# Altium project NavIC_F9P_RTK.PrjPcb
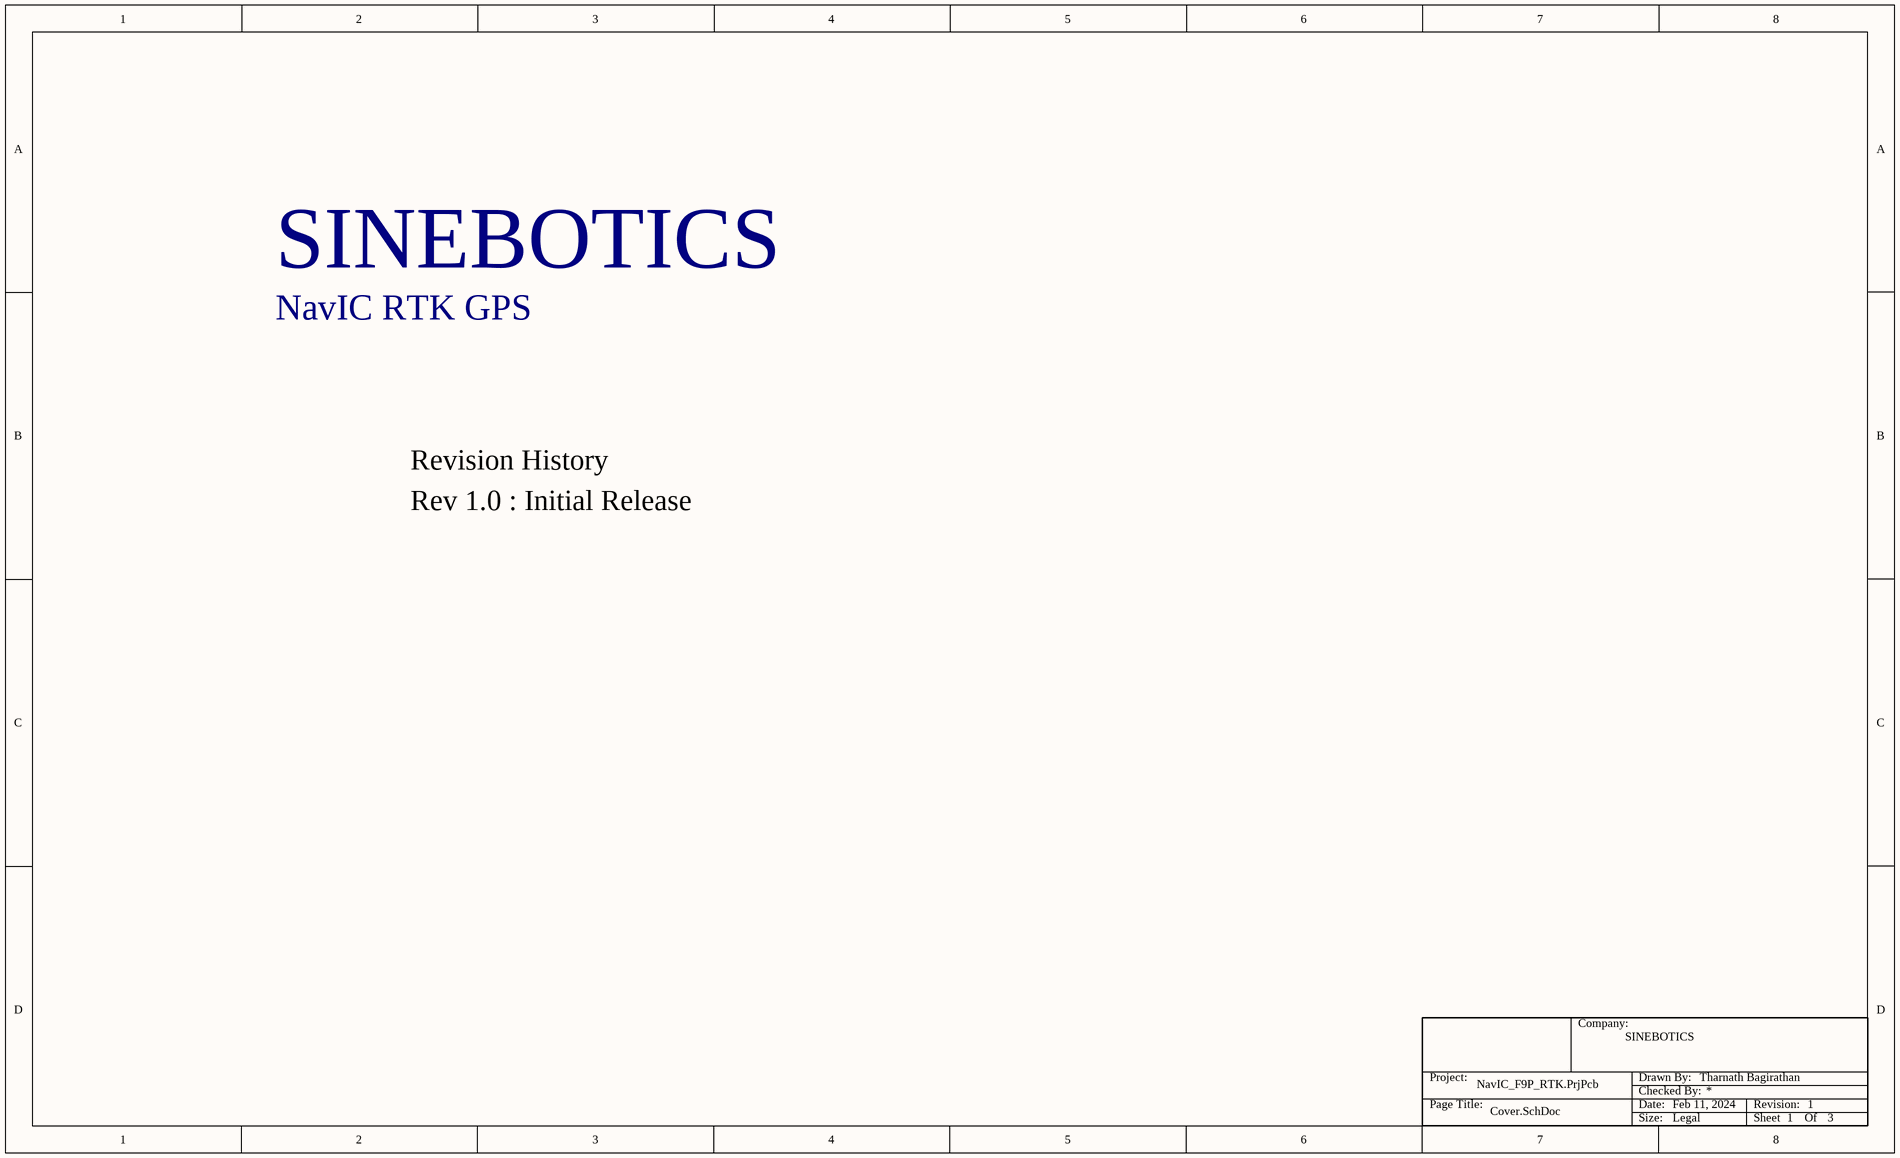
[diagram p0: Cover.SchDoc]
Date: Feb 11, 2024; Revision: 1; Size: Legal
3 sheets, 128 parts. Net scope: flat (ports and power ports of the same name join across sheets).
Board file: NavIC_PCB.PcbDoc
Sheets:
  Cover.SchDoc
  Power.SchDoc
  Sensors.SchDoc

## Sheet Cover.SchDoc
size Legal; CompanyName: SINEBOTICS; DrawnBy: Tharnath Bagirathan; SheetNumber: 1; SheetTotal: 3

### Parts
(Parts that share a designator on the sheet are numbered #1, #2 ... from top to bottom, then left to right.)
TitleBlock#1  TitleBlock  (value not drawn)  (graphical)

### Notes on the sheet
- SINEBOTICS
- NavIC RTK GPS
- Revision History
- Rev 1.0 : Initial Release
- (in symbol TitleBlock) Company:; Project:; Drawn By:; Checked By:; Page Title:; Date:; Revision:; Size:; Sheet        Of

### Library data of the parts
TitleBlock#1 = TitleBlock: TitleBlock For Schematics

## Sheet Power.SchDoc
size Legal; CompanyName: SINEBOTICS; DrawnBy: Tharnath Bagirathan; SheetNumber: 2; SheetTotal: 3
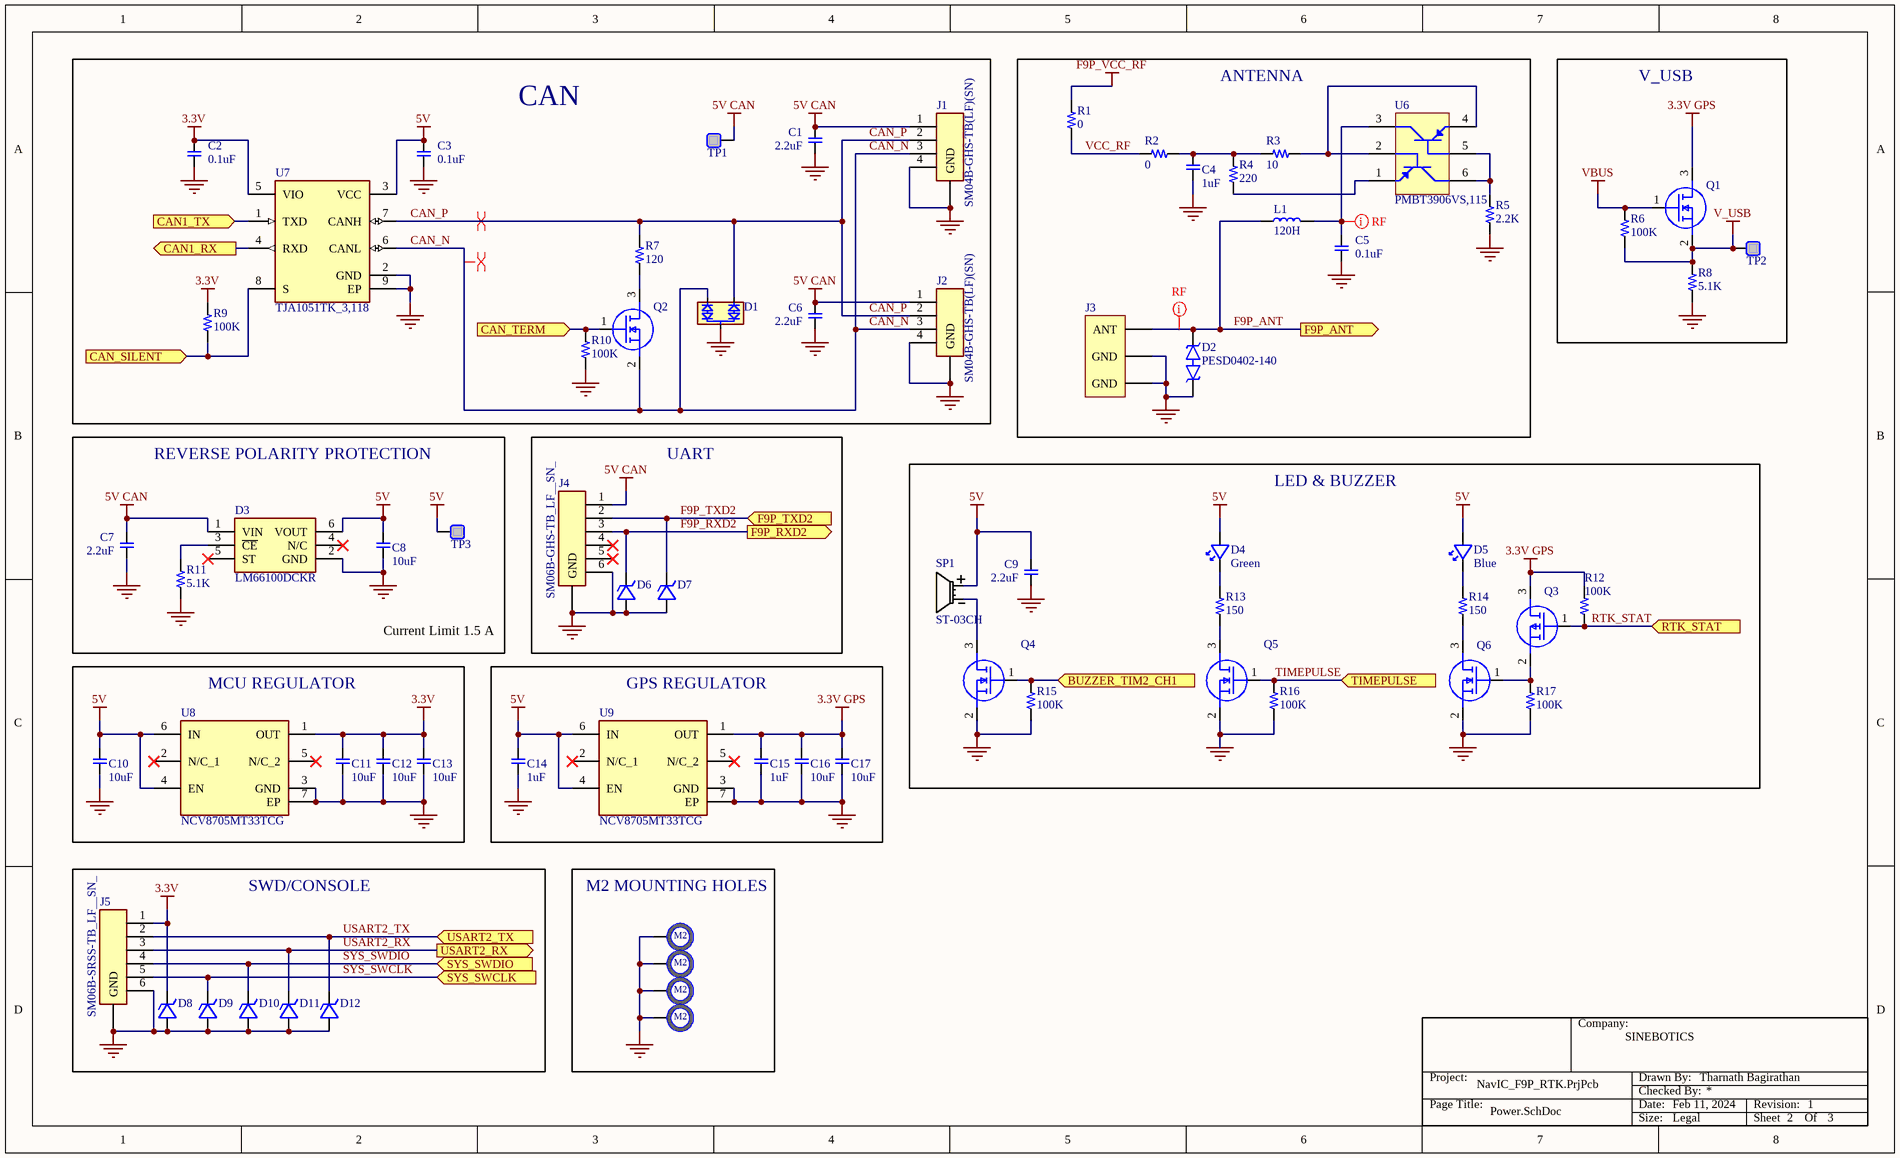
[diagram p1: Power.SchDoc]

### Parts
(Parts that share a designator on the sheet are numbered #1, #2 ... from top to bottom, then left to right.)
C1  2.2uF  [C0402]
C2  0.1uF  [C0402]
C3  0.1uF  [C0402]
C4  1uF  [C0402]
C5  0.1uF  [C0402]
C6  2.2uF  [C0402]
C7  2.2uF  [C0402]
C8  10uF  [C0402]
C9  2.2uF  [C0402]
C10  10uF  [C0402]
C11  10uF  [C0402]
C12  10uF  [C0402]
C13  10uF  [C0402]
C14  1uF  [C0402]
C15  1uF  [C0402]
C16  10uF  [C0402]
C17  10uF  [C0402]
D1  PESD1CAN-UX  [PESD1CANUX]  (value not drawn)
D2  PESD0402-140  [DIONC1005X43N]
D3  LM66100DCKR  [SOP65P210X110-6N]
D4  Green  [LTSTS110TBKT]
D5  Blue  [LTSTS110TBKT]
D6  ESD9C3.3ST5G  [SODFL1006X40N]  (value not drawn)
D7  ESD9C3.3ST5G  [SODFL1006X40N]  (value not drawn)
D8  ESD9C3.3ST5G  [SODFL1006X40N]  (value not drawn)
D9  ESD9C3.3ST5G  [SODFL1006X40N]  (value not drawn)
D10  ESD9C3.3ST5G  [SODFL1006X40N]  (value not drawn)
D11  ESD9C3.3ST5G  [SODFL1006X40N]  (value not drawn)
D12  ESD9C3.3ST5G  [SODFL1006X40N]  (value not drawn)
H1  M2  [Hole_M2]  (value not drawn)  (no BOM)
H2  M2  [Hole_M2]  (value not drawn)  (no BOM)
H3  M2  [Hole_M2]  (value not drawn)  (no BOM)
H4  M2  [Hole_M2]  (value not drawn)  (no BOM)
J1  SM04B-GHS-TB(LF)(SN)  [SM04B-GHS-TB]
J2  SM04B-GHS-TB(LF)(SN)  [SM04B-GHS-TB]
J3  0734150963  [MOLEX_0734150963]  (value not drawn)
J4  SM06B-GHS-TB_LF__SN_  [SM06B-GHS-TB]
J5  SM06B-SRSS-TB_LF__SN_  [SM06BSRSSTBLFSN]
L1  120H  [LQW15CNR20J00B]
Q1  DMN53D0L-7  [SOT96P240X110-3N]  (value not drawn)
Q2  DMN53D0L-7  [SOT96P240X110-3N]  (value not drawn)
Q3  BSS223PWH6327XTSA1  [SOT65P210X100-3N]  (value not drawn)
Q4  DMN53D0L-7  [SOT96P240X110-3N]  (value not drawn)
Q5  DMN53D0L-7  [SOT96P240X110-3N]  (value not drawn)
Q6  DMN53D0L-7  [SOT96P240X110-3N]  (value not drawn)
R1  0  [R0402]
R2  0  [R0402]
R3  10  [RESC3225X70N]
R4  220  [R0402]
R5  2.2K  [R0402]
R6  100K  [R0402]
R7  120  [RESC1608X55N]
R8  5.1K  [R0402]
R9  100K  [R0402]
R10  100K  [R0402]
R11  5.1K  [R0402]
R12  100K  [R0402]
R13  150  [R0402]
R14  150  [R0402]
R15  100K  [R0402]
R16  100K  [R0402]
R17  100K  [R0402]
SP1  ST-03CH  [ST03CH]
TitleBlock#2  TitleBlock  (value not drawn)  (graphical)
TP1  TestPad  [TestPad]  (value not drawn)  (no BOM)
TP2  TestPad  [TestPad]  (value not drawn)  (no BOM)
TP3  TestPad  [TestPad]  (value not drawn)  (no BOM)
U6  PMBT3906VS,115  [PMBT3906VS115]
U7  TJA1051TK_3,118  [SON65P300X300X100-9N-D]
U8  NCV8705MT33TCG  [SON65P200X200X80-7N]
U9  NCV8705MT33TCG  [SON65P200X200X80-7N]

### Blocks framed on the sheet
CAN: C1-C3 C6 D1 J1 J2 Q2 R7 R9 R10 TP1 U7
ANTENNA: C4 C5 D2 J3 L1 R1-R5 U6
V_USB: Q1 R6 R8 TP2
REVERSE POLARITY PROTECTION: C7 C8 D3 R11 TP3
UART: D6 D7 J4
LED & BUZZER: C9 D4 D5 Q3-Q6 R12-R17 SP1
MCU REGULATOR: C10-C13 U8
GPS REGULATOR: C14-C17 U9
SWD/CONSOLE: D8-D12 J5
M2 MOUNTING HOLES: H1-H4

### Ports
BUZZER_TIM2_CH1 (in, see Sensors[1A]), CAN1_RX (out, see Sensors[1A]), CAN1_TX (in, see Sensors[1A]), CAN_SILENT (in, see Sensors[1B]), CAN_TERM (in, see Sensors[1B]), F9P_ANT (out, see Sensors[3A]), F9P_RXD2 (out, see Sensors[3B]), F9P_TXD2 (in, see Sensors[3B]), RTK_STAT (in, see Sensors[4B]), SYS_SWCLK (in, see Sensors[1A]), SYS_SWDIO (in, see Sensors[1A]), TIMEPULSE (in, see Sensors[4B]), USART2_RX (out, see Sensors[1A]), USART2_TX (in, see Sensors[1A])

### Nets
3.3V: C2.2 C11.1 C12.1 C13.1 D8.1(K) J5.1 R9.2 U7.5(VIO) U8.1(OUT)
3.3V GPS: C15.2 C16.1 C17.1 Q1.3(D) Q3.3(D) R12.2 U9.1(OUT)
5V: C3.2 C8.1 C9.2 C10.2 C14.2 D3.6(VOUT) D4.2(A) D5.2(A) SP1.2(+POLARITY) TP3.1 U7.3(VCC) U8.4(EN) U8.6(IN) U9.4(EN) U9.6(IN)
5V CAN: C1.2 C6.2 C7.2 D3.1(VIN) J1.1 J2.1 J4.1 TP1.1
F9P_VCC_RF: R1.2
GND: C1.1 C2.1 C3.1 C4.1 C5.1 C6.1 C7.1 C8.2 C9.1 C10.1 C11.2 C12.2 C13.2 C14.1 C15.1 C16.2 C17.2 D1.3(_COMMON_CATHODE) D2.1 D3.2(GND) D6.2(A) D7.2(A) D8.2(A) D9.2(A) D10.2(A) D11.2(A) D12.2(A) H1.1 H2.1 H3.1 H4.1 J1.0(GND) J1.4 J2.0(GND) J2.4 J3.G1(GND) J3.G2(GND) J4.6 J4.7(GND) J5.6 J5.MP(GND) Q4.2(S) Q5.2(S) Q6.2(S) R5.1 R8.1 R10.1 R11.1 R15.1 R16.1 R17.1 U7.2(GND) U7.9(EP) U8.3(GND) U8.7(EP) U9.3(GND) U9.7(EP)
V_USB: Q1.2(S) R6.1 R8.2 TP2.1
VBUS: Q1.1(G) R6.2
BUZZER_TIM2_CH1: Q4.1(G) R15.2 ; port BUZZER_TIM2_CH1
CAN1_RX: U7.4(RXD) ; port CAN1_RX
CAN1_TX: U7.1(TXD) ; port CAN1_TX
CAN_N: D1.1(CATHODE_1) J1.3 J2.3 Q2.2(S) U7.6(CANL)
CAN_P: D1.2(CATHODE_2) J1.2 J2.2 R7.2 U7.7(CANH)
F9P_ANT: D2.2 J3.1(ANT) L1.1 ; port F9P_ANT
F9P_RXD2: D6.1(K) J4.3 ; port F9P_RXD2
F9P_TXD2: D7.1(K) J4.2 ; port F9P_TXD2
RTK_STAT: Q3.1(G) R12.1 ; port RTK_STAT
SYS_SWCLK: D9.1(K) J5.5 ; port SYS_SWCLK
SYS_SWDIO: D10.1(K) J5.4 ; port SYS_SWDIO
TIMEPULSE: Q5.1(G) R16.2 ; port TIMEPULSE
USART2_RX: D11.1(K) J5.3 ; port USART2_RX
USART2_TX: D12.1(K) J5.2 ; port USART2_TX
VCC_RF: R1.1 R2.1
NetC4_2: C4.2 R2.2 R3.1 R4.2
NetC5_2: C5.2 L1.2 U6.3(COLLECTOR_TR2)
NetD3_3: D3.3(~{CE}) R11.2
NetD4_1: D4.1(K) R13.1
NetD5_1: D5.1(K) R14.1
NetQ2_1: Q2.1(G) R10.2 ; port CAN_TERM
NetQ2_3: Q2.3(D) R7.1
NetQ3_2: Q3.2(S) Q6.1(G) R17.2
NetQ4_3: Q4.3(D) SP1.3(-POLARITY)
NetQ5_3: Q5.3(D) R13.2
NetQ6_3: Q6.3(D) R14.2
NetR3_2: R3.2 U6.2(BASE_TR1) U6.4(EMITTER_TR2)
NetR4_1: R4.1 U6.1(EMITTER_TR1)
NetR5_2: R5.2 U6.5(BASE_TR2) U6.6(COLLECTOR_TR1)
NetR9_1: R9.1 U7.8(S) ; port CAN_SILENT

Not connected (* = marked no-connect by the designer): D3 4(N/C)* 5(ST)*; J4 4* 5*; SP1 1(NC_1) 4(NC_2); U8 2(N/C_1)* 5(N/C_2)*; U9 2(N/C_1)* 5(N/C_2)*

### Layout directives
differential pair: CAN_N, CAN_P
net class RF: F9P_ANT, NetC5_2

### Notes on the sheet
- Current Limit 1.5 A
- (in symbol TitleBlock) Company:; Project:; Drawn By:; Checked By:; Page Title:; Date:; Revision:; Size:; Sheet        Of

### Library data of the parts
C1 C6 C7 C9 = CAP_0402: Capacitor 0402 Generic; Manufacturer Part Number: GRM155R61A225ME95D; Manufacturer: Murata; Manufacturer Part Description: CAP CER 2.2uF ±20% 10V X5R 0402 (1005 Metric)
C2 C3 C5 = CAP_0402: Capacitor 0402 Generic; Manufacturer Part Number: 0402X104K250CT; Manufacturer: Walsin Technology Corporation; Manufacturer Part Description: CAP CER 0.1uF ±10% 25V X5R 0402 (1005 Metric)
C4 C14 C15 = CAP_0402: Capacitor 0402 Generic; Manufacturer Part Number: CL05A105KP5NNNC; Manufacturer: Samsung Electro-Mechanics; Manufacturer Part Description: CAP CER 1uF ±10% 10V X5R 0402 (1005 Metric)
C8 C10-C13 C16 C17 = CAP_0402: Capacitor 0402 Generic; Manufacturer Part Number: CL05A106MP8NUB8; Manufacturer: Samsung Electro-Mechanics; Manufacturer Part Description: CAP CER 10uF ±20% 10V X5R 0402 (1005 Metric)
D1 = PESD1CAN-UX: Diode; Manufacturer Name: Nexperia; Datasheet Link: https://assets.nexperia.com/documents/data-sheet/PESD1CAN-U.pdf; Height: 1.1mm; Manufacturer_Part_Number: PESD1CAN-UX; Mouser Price/Stock: https://www.mouser.co.uk/ProductDetail/Nexperia/PESD1CAN-UX?qs=fi7yB2oewZmfG%252BI%252BwWS45Q%3D%3D; Arrow Part Number: PESD1CAN-UX; Arrow Price/Stock: https://www.arrow.com/en/products/pesd1can-ux/nexperia?region=nac; Manufacturer Part Number: PESD1CAN-UX
D2 = PESD0402-140: TVS Diode (Bi-directional); Manufacturer Name: LITTELFUSE; Datasheet Link: https://www.littelfuse.com/~/media/electronics/product_specifications/polymer_esd_suppressors/littelfuse_polymer_esd_suppressor_pesd0402_140_product_specification.pdf.pdf; Height: 0.43mm; Manufacturer_Part_Number: PESD0402-140; Mouser Price/Stock: https://www.mouser.co.uk/ProductDetail/Littelfuse/PESD0402-140?qs=y1EbU1W0OrtTHVfbQV6MTg%3D%3D; Arrow Part Number: PESD0402-140; Arrow Price/Stock: https://www.arrow.com/en/products/pesd0402-140/littelfuse?region=nac; Manufacturer Part Number: PESD0402-140
D3 = LM66100DCKR: Diode; Manufacturer Name: Texas Instruments; Datasheet Link: http://www.ti.com/lit/gpn/LM66100; Height: 1.1mm; Mouser Price/Stock: https://www.mouser.co.uk/ProductDetail/Texas-Instruments/LM66100DCKR?qs=vLWxofP3U2y2yPPrXoBBoA%3D%3D; Arrow Part Number: LM66100DCKR; Arrow Price/Stock: https://www.arrow.com/en/products/lm66100dckr/texas-instruments?region=europe; Manufacturer Part Number: LM66100DCKR
D4 = LTST-S110KGKT: LED; Manufacturer Name: Lite-On; Datasheet Link: https://www.mouser.com/datasheet/2/239/LTST-S110KGKT-1142085.pdf; Height: 1.5mm; Mouser Price/Stock: https://www.mouser.co.uk/ProductDetail/Lite-On/LTST-S110TBKT?qs=NfjNG%252BhMu8ZWYNEUDjruGQ%3D%3D; Arrow Part Number: LTST-S110TBKT; Arrow Price/Stock: https://www.arrow.com/en/products/ltst-s110tbkt/lite-on-technology?region=europe; Manufacturer Part Number: LTST-S110KGKT
D5 = LTST-S110TBKT: LED; Manufacturer Name: Lite-On; Datasheet Link: https://datasheet.datasheetarchive.com/originals/distributors/Datasheets-DGA13/1154201.pdf; Height: 1.5mm; Mouser Price/Stock: https://www.mouser.co.uk/ProductDetail/Lite-On/LTST-S110TBKT?qs=NfjNG%252BhMu8ZWYNEUDjruGQ%3D%3D; Arrow Part Number: LTST-S110TBKT; Arrow Price/Stock: https://www.arrow.com/en/products/ltst-s110tbkt/lite-on-technology?region=europe; Manufacturer Part Number: LTST-S110TBKT
D6-D12 = ESD9C3.3ST5G: TVS Diode (Uni-directional); Manufacturer Name: onsemi; Datasheet Link: https://componentsearchengine.com/Datasheets/1/ESD9C3.3ST5G.pdf; Height: 0.4mm; Mouser Price/Stock: https://www.mouser.co.uk/ProductDetail/onsemi/SZESD9C3.3ST5G?qs=dbuNSGnowt0DiTOhuMf8NQ%3D%3D; Arrow Part Number: SZESD9C3.3ST5G; Arrow Price/Stock: https://www.arrow.com/en/products/szesd9c3.3st5g/on-semiconductor; Manufacturer Part Number: ESD9C3.3ST5G
H1-H4 = Hole_M2
J1 J2 = SM04B-GHS-TB(LF)(SN): Connector; pin to pad: 0>5+6; Manufacturer Name: JST (JAPAN SOLDERLESS TERMINALS); Datasheet Link: http://uk.rs-online.com/web/p/products/7521797; Manufacturer_Part_Number: SM04B-GHS-TB(LF)(SN); Arrow Part Number: SM04B-GHS-TB(LF)(SN); Arrow Price/Stock: https://www.arrow.com/en/products/sm04b-ghs-tb-lf-sn-/jst-manufacturing?region=europe; Manufacturer Part Number: SM04B-GHS-TB(LF)(SN)
J3 = 0734150963: MMCX Connector Jack, Female Socket 50Ohm Board Edge, Cutout; Surface Mount Solder; MF: Molex; Price: None; Purchase-URL: https://pricing.snapeda.com/search/part/0734150963/?ref=eda; Package: None; Check_prices: https://www.snapeda.com/parts/0734150963/Molex/view-part/?ref=eda; Availability: In Stock; MP: 0734150963; Value: *; SnapEDA_Link: https://www.snapeda.com/parts/0734150963/Molex/view-part/?ref=snap
J4 = SM06B-GHS-TB_LF__SN_: Connector; pin to pad: 7>7+8; Manufacturer_Part_Number: SM06B-GHS-TB(LF)(SN); Manufacturer Name: JST (JAPAN SOLDERLESS TERMINALS); Datasheet Link: https://datasheet.datasheetarchive.com/originals/distributors/Datasheets_SAMA/e4ef010dc292ea31091454f6c0afb63a.pdf; Arrow Part Number: SM06B-GHS-TB(LF)(SN); Arrow Price/Stock: https://www.arrow.com/en/products/sm06b-ghs-tb-lf-sn/jst-manufacturing; Manufacturer Part Number: SM06B-GHS-TB(LF)(SN)
J5 = SM06B-SRSS-TB_LF__SN_: Connector; pin to pad: MP>MP1+MP2; Manufacturer Name: JST (JAPAN SOLDERLESS TERMINALS); Manufacturer Part Number: SM06B-SRSS-TB(LF)(SN); Datasheet Link: http://www.jst-mfg.com/product/pdf/eng/eSH.pdf; Height: 2.95mm; Mouser Part Number: SM06B-SRSS-TB(LF)(SN); Arrow Part Number: SM06B-SRSS-TB(LF)(SN); Arrow Price/Stock: https://www.arrow.com/en/products/sm06b-srss-tb-lf-sn/jst-manufacturing?region=europe
L1 = LQW15ANR12J00D: Inductor; Manufacturer Name: Murata Electronics; Datasheet Link: https://datasheet.datasheetarchive.com/originals/distributors/Datasheets_SAMA/97451af591734477ab6d2485aab35b5f.pdf; Height: 0.6mm; Mouser Price/Stock: https://www.mouser.co.uk/ProductDetail/Murata-Electronics/LQW15ANR12J00D/?qs=UV0HhPl4yOHsBH0%2FSRErMg%3D%3D; Arrow Part Number: LQW15ANR12J00D; Arrow Price/Stock: https://www.arrow.com/en/products/lqw15anr12j00d/murata-manufacturing?region=nac; Manufacturer Part Number: LQW15ANR12J00D
Q1 Q2 Q4-Q6 = DMN53D0L-7: MOSFET (N-Channel); Manufacturer Name: Diodes Incorporated; Datasheet Link: http://uk.rs-online.com/web/p/products/9211101P; Height: 1.1mm; Mouser Price/Stock: https://www.mouser.com/Search/Refine.aspx?Keyword=621-DMN53D0L-7; Arrow Part Number: DMN53D0L-7; Arrow Price/Stock: https://www.arrow.com/en/products/dmn53d0l-7/diodes-incorporated; Manufacturer Part Number: DMN53D0L-7
Q3 = BSS223PWH6327XTSA1: MOSFET (P-Channel); Manufacturer Name: Infineon; Datasheet Link: https://componentsearchengine.com/Datasheets/2/BSS223PWH6327XTSA1.pdf; Height: 1mm; Mouser Price/Stock: https://www.mouser.co.uk/ProductDetail/Infineon-Technologies/BSS223PWH6327XTSA1?qs=Dj8dEyEphkMhtpM4HseAjA%3D%3D; Arrow Part Number: BSS223PWH6327XTSA1; Arrow Price/Stock: https://www.arrow.com/en/products/bss223pwh6327xtsa1/infineon-technologies-ag; Manufacturer Part Number: BSS223PWH6327XTSA1
R1 R2 = RES_0402: Resistor 0402 Generic; Manufacturer: Yageo; Manufacturer Part Number: AC0402JR-070RL; Manufacturer Part Description: RES 0 Ohm Jumper 1/16W 0402 (1005 Metric)
R3 = RES_10_1/2W: Resistor; Manufacturer_Part_Number: RMCF1210JT10R0; Manufacturer Name: Stackpole Electronics; Datasheet Link: https://cs.seielect.com/catalog/SEI-RMCF_RMCP.pdf; Height: 0.7mm; Mouser Price/Stock: https://www.mouser.co.uk/ProductDetail/SEI-Stackpole/RMCF1210JT10R0?qs=FESYatJ8odJ2YkqCzkIQWw%3D%3D; Arrow Part Number: RMCF1210JT10R0; Arrow Price/Stock: https://www.arrow.com/en/products/rmcf1210jt10r0/stackpole-electronics?region=nac; Manufacturer Part Number: RMCF1210JT10R0
R4 = RES_0402: Resistor 0402 Generic; Manufacturer: Stackpole Electronics Inc; Manufacturer Part Number: RMCF0402JT220R; Manufacturer Part Description: RES 220 Ohm ±5% 1/16W 0402 (1005 Metric)
R5 = RES_0402: Resistor 0402 Generic; Manufacturer: Yageo; Manufacturer Part Number: AC0402FR-072K2L; Manufacturer Part Description: RES 2.2K Ohm ±1% 1/16W 0402 (1005 Metric)
R6 R9 R10 R12 R15-R17 = RES_0402: Resistor 0402 Generic; Manufacturer: Yageo; Manufacturer Part Number: AC0402JR-07100KL; Manufacturer Part Description: RES 100K Ohm ±5% 1/16W 0402 (1005 Metric)
R7 = RES_120: Resistor; Manufacturer_Part_Number: RMCF0603FT120R; Manufacturer Name: Stackpole Electronics; Datasheet Link: https://www.seielect.com/Catalog/SEI-RMCF_RMCP.pdf; Height: 0.55mm; Arrow Part Number: RMCF0603FT120R; Arrow Price/Stock: https://www.arrow.com/en/products/rmcf0603ft120r/stackpole-electronics; Manufacturer Part Number: RMCF0603FT120R
R8 R11 = RES_0402: Resistor 0402 Generic; Manufacturer: Yageo; Manufacturer Part Number: RC0402FR-075K1L; Manufacturer Part Description: RES 5.1K Ohm ±1% 1/16W 0402 (1005 Metric)
R13 R14 = RES_0402: Resistor 0402 Generic; Manufacturer: Stackpole Electronics Inc; Manufacturer Part Number: RC0402FR-07150RL; Manufacturer Part Description: RES 150 Ohm ±1% 1/16W 0402 (1005 Metric)
SP1 = ST-03CH: Loudspeaker or Buzzer; Manufacturer_Name: Soberton Inc.; Datasheet Link: https://www.soberton.com/wp-content/uploads/2019/02/ST-03CH-19-Feb-2019.pdf; Height: 3.5mm; Mouser Part Number: ST-03CH; Manufacturer Part Number: ST-03CH
TitleBlock#2 = TitleBlock: TitleBlock For Schematics
TP1-TP3 = TestPad: Test Pads
U6 = PMBT3906VS,115: Transistor BJT PNP; Manufacturer Name: Nexperia; Datasheet Link: https://assets.nexperia.com/documents/data-sheet/PMBT3906VS.pdf; Height: 0.6mm; Mouser Part Number: PMBT3906VS,115; Mouser Price/Stock: https://www.mouser.co.uk/ProductDetail/Nexperia/PMBT3906VS115?qs=LMSg3oBIm%2FguPDYx3FiBDA%3D%3D; Arrow Part Number: PMBT3906VS,115; Arrow Price/Stock: https://www.arrow.com/en/products/pmbt3906vs115/nexperia?region=nac; Manufacturer Part Number: PMBT3906VS,115
U7 = TJA1051TK_3,118: Integrated Circuit; Manufacturer_Name: NXP; Manufacturer_Part_Number: TJA1051TK/3,118; Datasheet Link: http://www.nxp.com/docs/en/data-sheet/TJA1051.pdf; Height: 1mm; Mouser Price/Stock: https://www.mouser.co.uk/ProductDetail/NXP-Semiconductors/TJA1051TK-3118?qs=fhAOlxDPaYVrDQ2e4g%252BBJA%3D%3D; Arrow Part Number: TJA1051TK/3,118; Arrow Price/Stock: https://www.arrow.com/en/products/tja1051tk3118/nxp-semiconductors?region=nac; Manufacturer Part Number: TJA1051TK/3,118
U8 U9 = NCV8705MT33TCG: Integrated Circuit; Manufacturer Name: onsemi; Datasheet Link: https://mouser.componentsearchengine.com/Datasheets/2/NCV8705MT33TCG.pdf; Height: 0.8mm; Mouser Part Number: NCV8705MT33TCG; Mouser Price/Stock: https://www.mouser.co.uk/ProductDetail/onsemi/NCV8705MT33TCG?qs=dbuNSGnowt08ckPc9kUZHw%3D%3D; Arrow Part Number: NCV8705MT33TCG; Arrow Price/Stock: https://www.arrow.com/en/products/ncv8705mt33tcg/on-semiconductor; Manufacturer Part Number: NCV8705MT33TCG

## Sheet Sensors.SchDoc
size Legal; Date: Feb 11, 2024; CompanyName: SINEBOTICS; DrawnBy: Tharnath Bagirathan; SheetNumber: 3; SheetTotal: 3
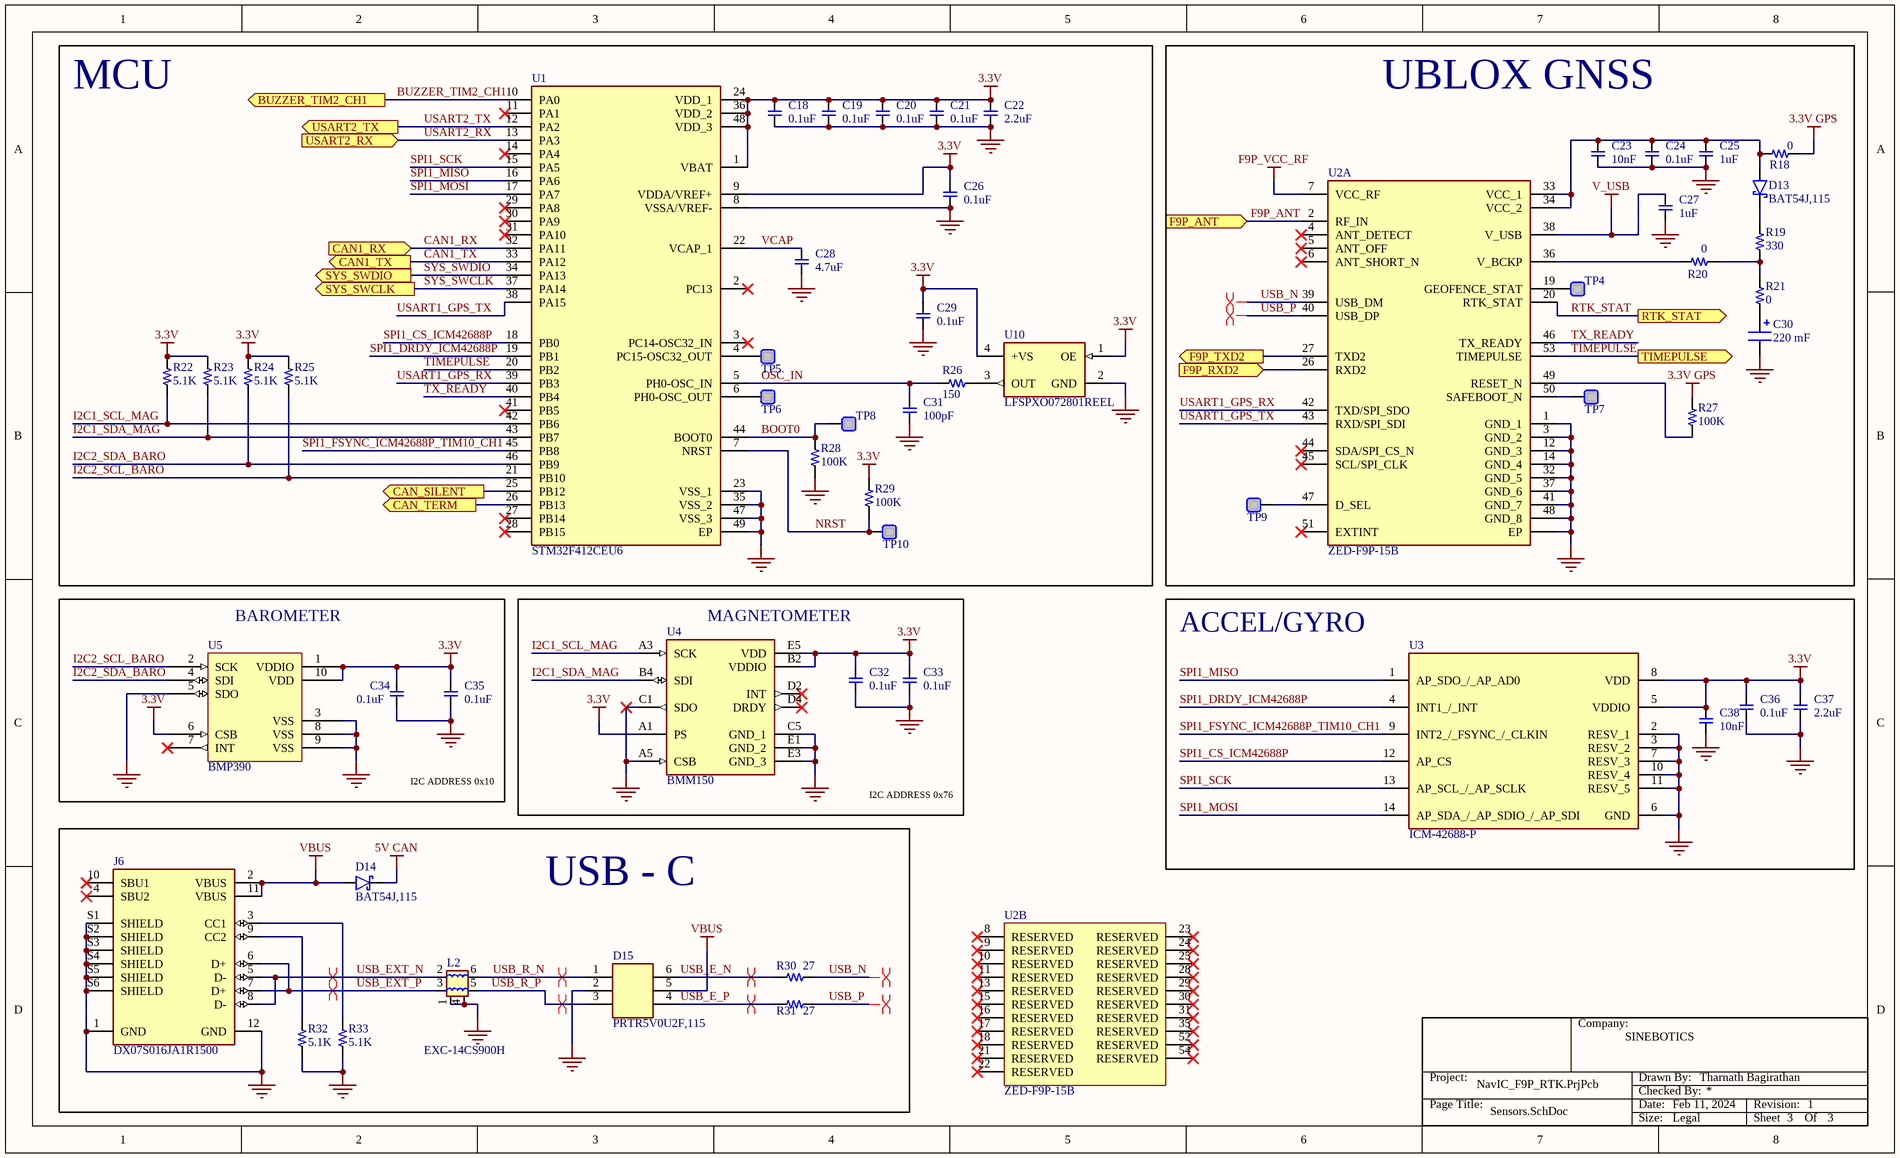
[diagram p2: Sensors.SchDoc]

### Parts
(Parts that share a designator on the sheet are numbered #1, #2 ... from top to bottom, then left to right.)
C18  0.1uF  [C0402]
C19  0.1uF  [C0402]
C20  0.1uF  [C0402]
C21  0.1uF  [C0402]
C22  2.2uF  [C0402]
C23  10nF  [C0402]
C24  0.1uF  [C0402]
C25  1uF  [C0402]
C26  0.1uF  [C0402]
C27  1uF  [C0402]
C28  4.7uF  [C0402]
C29  0.1uF  [C0402]
C30  220 mF  [DSK3R3H334THL]
C31  100pF  [C0402]
C32  0.1uF  [C0402]
C33  0.1uF  [C0402]
C34  0.1uF  [C0402]
C35  0.1uF  [C0402]
C36  0.1uF  [C0402]
C37  2.2uF  [C0402]
C38  10nF  [C0402]
D13  BAT54J,115  [SODFL2512X80N]
D14  BAT54J,115  [SODFL2512X80N]
D15  PRTR5V0U2F,115  [PESD3V3L5UF115]
J6  DX07S016JA1R1500  [JAE_DX07S016JA1R1500]
L2  EXC-14CS900H  [EXC14CS900H]
R18  0  [R0402]
R19  330  [R0402]
R20  0  [R0402]
R21  0  [R0402]
R22  5.1K  [R0402]
R23  5.1K  [R0402]
R24  5.1K  [R0402]
R25  5.1K  [R0402]
R26  150  [R0402]
R27  100K  [R0402]
R28  100K  [R0402]
R29  100K  [R0402]
R30  27  [R0402]
R31  27  [R0402]
R32  5.1K  [R0402]
R33  5.1K  [R0402]
TitleBlock#3  TitleBlock  (value not drawn)  (graphical)
TP4  TestPad  [TestPad]  (value not drawn)  (no BOM)
TP5  TestPad  [TestPad]  (value not drawn)  (no BOM)
TP6  TestPad  [TestPad]  (value not drawn)  (no BOM)
TP7  TestPad  [TestPad]  (value not drawn)  (no BOM)
TP8  TestPad  [TestPad]  (value not drawn)  (no BOM)
TP9  TestPad  [TestPad]  (value not drawn)  (no BOM)
TP10  TestPad  [TestPad]  (value not drawn)  (no BOM)
U1  STM32F412CEU6  [QFN50P700X700X65-49N-D]
U2  ZED-F9P-15B  [ZEDF9P15B]  (parts A,B of 2)
U3  ICM-42688-P  [IIM42352]
U4  BMM150  [BMM150]
U5  BMP390  [BMP390]
U10  LFSPXO072801REEL  [LFSPXO072801REEL]

### Blocks framed on the sheet
MCU: C18-C22 C26 C28 C29 C31 R22-R26 R28 R29 TP5 TP6 TP8 TP10 U1 U10
UBLOX GNSS: C23-C25 C27 C30 D13 R18-R21 R27 TP4 TP7 TP9 U2
BAROMETER: C34 C35 U5
MAGNETOMETER: C32 C33 U4
ACCEL/GYRO: C36-C38 U3
USB - C: D14 D15 J6 L2 R30-R33

### Ports
BUZZER_TIM2_CH1 (out, see Power[3C]), CAN1_RX (in, see Power[1A]), CAN1_TX (out, see Power[1A]), CAN_SILENT (out, see Power[1B]), CAN_TERM (out, see Power[2B]), F9P_ANT (in, see Power[3B]), F9P_RXD2 (in, see Power[2B]), F9P_TXD2 (out, see Power[2B]), RTK_STAT (out, see Power[4C]), SYS_SWCLK (out, see Power[1D]), SYS_SWDIO (out, see Power[1D]), TIMEPULSE (out, see Power[3C]), USART2_RX (in, see Power[1D]), USART2_TX (out, see Power[1D])

### Nets
3.3V: C18.2 C19.2 C20.2 C21.2 C22.2 C26.2 C29.2 C32.2 C33.2 C34.2 C35.2 C36.2 C37.2 C38.2 R22.2 R23.2 R24.2 R25.2 R29.2 U1.1(VBAT) U1.9(VDDA/VREF+) U1.24(VDD_1) U1.36(VDD_2) U1.48(VDD_3) U3.5(VDDIO) U3.8(VDD) U4.A1(PS) U4.B2(VDDIO) U4.E5(VDD) U5.1(VDDIO) U5.6(CSB) U5.10(VDD) U10.1(OE) U10.4(+VS)
3.3V GPS: R18.2 R27.2
5V CAN: D14.1(K)
F9P_VCC_RF: U2.7(VCC_RF)
GND: C18.1 C19.1 C20.1 C21.1 C22.1 C23.1 C24.1 C25.1 C26.1 C27.1 C28.1 C29.1 C30.2(-) C31.1 C32.1 C33.1 C34.1 C35.1 C36.1 C37.1 C38.1 D15.2(ground) J6.1(GND) J6.12(GND) J6.S1(SHIELD) J6.S2(SHIELD) J6.S3(SHIELD) J6.S4(SHIELD) J6.S5(SHIELD) J6.S6(SHIELD) L2.1(GND_1) L2.4(GND_2) R28.1 R32.1 R33.1 U1.8(VSSA/VREF-) U1.23(VSS_1) U1.35(VSS_2) U1.47(VSS_3) U1.49(EP) U2.1(GND_1) U2.3(GND_2) U2.12(GND_3) U2.14(GND_4) U2.32(GND_5) U2.37(GND_6) U2.41(GND_7) U2.48(GND_8) U2.55(EP) U3.2(RESV_1) U3.3(RESV_2) U3.6(GND) U3.7(RESV_3) U3.10(RESV_4) U3.11(RESV_5) U4.A5(CSB) U4.C1(SDO) U4.C5(GND_1) U4.E1(GND_2) U4.E3(GND_3) U5.3(VSS) U5.5(SDO) U5.8(VSS) U5.9(VSS) U10.2(GND)
V_USB: C27.2 U2.38(V_USB)
VBUS: D14.2(A) D15.5(supply_voltage) J6.2(VBUS) J6.11(VBUS)
BOOT0: R28.2 TP8.1 U1.44(BOOT0)
BUZZER_TIM2_CH1: U1.10(PA0) ; port BUZZER_TIM2_CH1
CAN1_RX: U1.32(PA11) ; port CAN1_RX
CAN1_TX: U1.33(PA12) ; port CAN1_TX
F9P_ANT: U2.2(RF_IN) ; port F9P_ANT
F9P_RXD2: U2.26(RXD2) ; port F9P_RXD2
F9P_TXD2: U2.27(TXD2) ; port F9P_TXD2
I2C1_SCL_MAG: R22.1 U1.42(PB6) U4.A3(SCK)
I2C1_SDA_MAG: R23.1 U1.43(PB7) U4.B4(SDI)
I2C2_SCL_BARO: R25.1 U1.21(PB10) U5.2(SCK)
I2C2_SDA_BARO: R24.1 U1.46(PB9) U5.4(SDI)
NRST: R29.1 TP10.1 U1.7(NRST)
OSC_IN: C31.2 R26.2 U1.5(PH0-OSC_IN)
RTK_STAT: U2.20(RTK_STAT) ; port RTK_STAT
SPI1_CS_ICM42688P: U1.18(PB0) U3.12(AP_CS)
SPI1_DRDY_ICM42688P: U1.19(PB1) U3.4(INT1_/_INT)
SPI1_FSYNC_ICM42688P_TIM10_CH1: U1.45(PB8) U3.9(INT2_/_FSYNC_/_CLKIN)
SPI1_MISO: U1.16(PA6) U3.1(AP_SDO_/_AP_AD0)
SPI1_MOSI: U1.17(PA7) U3.14(AP_SDA_/_AP_SDIO_/_AP_SDI)
SPI1_SCK: U1.15(PA5) U3.13(AP_SCL_/_AP_SCLK)
SYS_SWCLK: U1.37(PA14) ; port SYS_SWCLK
SYS_SWDIO: U1.34(PA13) ; port SYS_SWDIO
TIMEPULSE: U1.20(PB2) U2.53(TIMEPULSE) ; port TIMEPULSE
TX_READY: U1.40(PB4) U2.46(TX_READY)
USART1_GPS_RX: U1.39(PB3) U2.42(TXD/SPI_SDO)
USART1_GPS_TX: U1.38(PA15) U2.43(RXD/SPI_SDI)
USART2_RX: U1.13(PA3) ; port USART2_RX
USART2_TX: U1.12(PA2) ; port USART2_TX
USB_E_N: D15.6(input/output_1_2) R30.1
USB_E_P: D15.4(input/output_2_2) R31.2
USB_EXT_N: J6.5(D-) J6.8(D-) L2.2(COIL_1)
USB_EXT_P: J6.6(D+) J6.7(D+) L2.3(COIL_2)
USB_N: R30.2 U2.39(USB_DM)
USB_P: R31.1 U2.40(USB_DP)
USB_R_N: D15.1(input/output_1_1) L2.6(COIL_4)
USB_R_P: D15.3(input/output_2_1) L2.5(COIL_3)
VCAP: C28.2 U1.22(VCAP_1)
NetC23_2: C23.2 C24.2 C25.2 D13.2(A) R18.1 U2.33(VCC_1) U2.34(VCC_2)
NetC30_1: C30.1(+) R21.1
NetD13_1: D13.1(K) R19.2
NetJ6_3: J6.3(CC1) R33.2
NetJ6_9: J6.9(CC2) R32.2
NetQ2_1: U1.26(PB13) ; port CAN_TERM
NetR9_1: U1.25(PB12) ; port CAN_SILENT
NetR19_1: R19.1 R20.2 R21.2
NetR20_1: R20.1 U2.36(V_BCKP)
NetR26_1: R26.1 U10.3(OUT)
NetR27_1: R27.1 U2.49(RESET_N)
NetTP4_1: TP4.1 U2.19(GEOFENCE_STAT)
NetTP5_1: TP5.1 U1.4(PC15-OSC32_OUT)
NetTP6_1: TP6.1 U1.6(PH0-OSC_OUT)
NetTP7_1: TP7.1 U2.50(SAFEBOOT_N)
NetTP9_1: TP9.1 U2.47(D_SEL)

Not connected (* = marked no-connect by the designer): J6 4(SBU2)* 10(SBU1)*; U1 2(PC13)* 3(PC14-OSC32_IN)* 11(PA1)* 14(PA4)* 27(PB14)* 28(PB15)* 29(PA8)* 30(PA9)* 31(PA10)* 41(PB5)*; U2 4(ANT_DETECT)* 5(ANT_OFF)* 6(ANT_SHORT_N)* 8(RESERVED)* 9(RESERVED)* 10(RESERVED)* 11(RESERVED)* 13(RESERVED)* 15(RESERVED)* 16(RESERVED)* 17(RESERVED)* 18(RESERVED)* 21(RESERVED)* 22(RESERVED)* 23(RESERVED)* 24(RESERVED)* 25(RESERVED)* 28(RESERVED)* 29(RESERVED)* 30(RESERVED)* 31(RESERVED)* 35(RESERVED)* 44(SDA/SPI_CS_N)* 45(SCL/SPI_CLK)* 51(EXTINT)* 52(RESERVED)* 54(RESERVED)*; U4 D2(INT)* D4(DRDY)*; U5 7(INT)*

### Layout directives
differential pair: USB_E_N, USB_E_P, USB_EXT_N, USB_EXT_P, USB_N, USB_P, USB_R_N, USB_R_P

### Notes on the sheet
- I2C ADDRESS 0x10
- I2C ADDRESS 0x76
- (in symbol TitleBlock) Company:; Project:; Drawn By:; Checked By:; Page Title:; Date:; Revision:; Size:; Sheet        Of

### Library data of the parts
C18-C21 C24 C26 C29 C32-C36 = CAP_0402: as C2 on sheet Power
C22 C37 = CAP_0402: as C1 on sheet Power
C23 C38 = CAP_0402: Capacitor 0402 Generic; Manufacturer Part Number: CL05B103KA5NNNC; Manufacturer: Samsung; Manufacturer Part Description: CAP CER 10000pF ±10% 25V X7R 0402 (1005 Metric)
C25 C27 = CAP_0402: as C4 on sheet Power
C28 = CAP_0402: Capacitor 0402 Generic; Manufacturer Part Number: C1005X5R0J475K050BC; Manufacturer: TDK Corporation; Manufacturer Part Description: CAP CER 4.7uF ±10% 6.3V X5R 0402 (1005 Metric)
C30 = DSK-3R3H224U-HL: Capacitor Polarised; Manufacturer Name: Elna; Datasheet Link: https://componentsearchengine.com/Datasheets/1/DSK-3R3H224U-HL.pdf; Height: 3mm; Mouser Price/Stock: https://www.mouser.co.uk/ProductDetail/Elna/DSK-3R3H224U-HL?qs=QQsyD2Kvh2ftLwsh6FwcaA%3D%3D; Manufacturer Part Number: DSK-3R3H224U-HL
C31 = CAP_0402: Capacitor 0402 Generic; Manufacturer Part Number: CL05C101JB5NNNC; Manufacturer: Samsung Electro-Mechanics; Manufacturer Part Description: CAP CER 100pF ±5% 50V NPO 0402 (1005 Metric)
D13 D14 = BAT54J,115: Schottky Diode; Manufacturer Name: Nexperia; Datasheet Link: https://assets.nexperia.com/documents/data-sheet/BAT54J.pdf; Height: 0.8mm; Mouser Price/Stock: https://www.mouser.co.uk/ProductDetail/Nexperia/BAT54J115?qs=me8TqzrmIYVxNBNrx1zKWQ%3D%3D; Arrow Part Number: BAT54J,115; Arrow Price/Stock: https://www.arrow.com/en/products/bat54j115/nexperia?region=europe; Manufacturer Part Number: BAT54J,115
D15 = PRTR5V0U2F,115: Diode; Manufacturer Name: Nexperia; Datasheet Link: https://assets.nexperia.com/documents/data-sheet/PRTR5V0U2F_PRTR5V0U2K.pdf; Height: 0.5mm; Manufacturer_Part_Number: PRTR5V0U2F,115; Mouser Price/Stock: https://www.mouser.co.uk/ProductDetail/Nexperia/PRTR5V0U2F115?qs=LOCUfHb8d9uDeQFPTHx5Dg%3D%3D; Arrow Part Number: PRTR5V0U2F,115; Arrow Price/Stock: https://www.arrow.com/en/products/prtr5v0u2f115/nexperia?region=europe; Manufacturer Part Number: PRTR5V0U2F,115
J6 = DX07S016JA1R1500: USB-C (USB TYPE-C) USB 2.0 Receptacle Connector 24 (16+8 Dummy) Position Surface Mount, Right Angle; Through Hole; Manufacturer Name: JAE Electronics; Package: None; Price: None; Manufacturer Part Number: DX07S016JA1R1500
L2 = EXC-14CS900H: Filter; Manufacturer Name: Panasonic; Datasheet Link: http://www.mouser.com/datasheet/2/315/AWE0000C291-1283916.pdf; Height: 0.5mm; Mouser Price/Stock: https://www.mouser.co.uk/ProductDetail/Panasonic/EXC-14CS900H?qs=f9yNj16SXrIzBMQRKJh4tA%3D%3D; Arrow Part Number: EXC-14CS900H; Arrow Price/Stock: https://www.arrow.com/en/products/exc-14cs900h/panasonic?region=nac; Manufacturer Part Number: EXC-14CS900H
R18 R20 R21 = RES_0402: as R1 on sheet Power
R19 = RES_0402: Resistor 0402 Generic; Manufacturer: Yageo; Manufacturer Part Number: RC0402FR-07330RL; Manufacturer Part Description: RES 330 Ohm ±1% 1/16W 0402 (1005 Metric)
R22-R25 R32 R33 = RES_0402: as R8 on sheet Power
R26 = RES_0402: as R13 on sheet Power
R27-R29 = RES_0402: as R6 on sheet Power
R30 R31 = RES_0402: Resistor 0402 Generic; Manufacturer: Yageo; Manufacturer Part Number: AC0402FR-0727RL; Manufacturer Part Description: RES 27 Ohm ±1% 1/16W 0402 (1005 Metric)
TitleBlock#3 = TitleBlock: TitleBlock For Schematics
TP4-TP10 = TestPad: Test Pads
U1 = STM32F412CEU6: ARM Microcontrollers - MCU 16/32-BITS MICROS; Manufacturer Name: STMicroelectronics; Geometry.Height: 0.65mm; Mouser Price/Stock: https://www.mouser.co.uk/ProductDetail/STMicroelectronics/STM32F412CEU6?qs=xwQlLnDx56BQrVh57SaY3Q%3D%3D; Datasheet Link: https://www.st.com/resource/en/datasheet/stm32f412ve.pdf; Manufacturer Part Number: STM32F412CEU6
U2 = ZED-F9P-15B: Ublox F9P-15B Dual Band GNSS Receiver; pin to pad: 55>55+56+57+58+59+60+61+62+63+64+65+66+67+68+69+70+71+72+73+74+75+76+77+78+79+80+81+82+83+84+85+86+87+88+89+90+91+92+93+94+95+96+97+98+99+100+101+102; Manufacturer Name: U-Blox; Datasheet Link: https://content.u-blox.com/sites/default/files/documents/ZED-F9P-15B_DataSheet_UBX-23009090.pdf; Height: 2.6mm; Manufacturer Part Number: ZED-F9P-15B
U3 = ICM-42688-P: Integrated Circuit; Manufacturer Name: TDK; Datasheet Link: https://3cfeqx1hf82y3xcoull08ihx-wpengine.netdna-ssl.com/wp-content/uploads/2021/06/DS-000347-ICM-42688-P-v1.5.pdf; Mouser Price/Stock: https://www.mouser.co.uk/ProductDetail/TDK-InvenSense/ICM-42688-P?qs=OlC7AqGiEDk8QrNAV728zw%3D%3D; Arrow Part Number: ICM-42688-P; Arrow Price/Stock: https://www.arrow.com/en/products/icm-42688-p/invensense?region=nac; Manufacturer Part Number: ICM-42688-P
U4 = BMM150: Integrated Circuit; Manufacturer Name: BOSCH; Datasheet Link: https://www.arrow.com/en/products/bmm150/bosch; Height: 0.6mm; Mouser Price/Stock: https://www.mouser.co.uk/ProductDetail/Bosch-Sensortec/BMM150?qs=d72FGnIDsgTOmKpCEe6mYw%3D%3D; Arrow Part Number: BMM150; Arrow Price/Stock: https://www.arrow.com/en/products/bmm150/bosch?region=nac; Manufacturer Part Number: BMM150
U5 = BMP390: Bosch Sensortec BMP390 Barometer; Manufacturer: Bosch Sensortec; Manufacturer Part Number: BMP390
U10 = LFSPXO072801REEL: Crystal or Oscillator; Manufacturer Name: IQD; Datasheet Link: https://eu.mouser.com/datasheet/2/741/LFSPXO072801Reel-1543851.pdf; Height: 1mm; Mouser Price/Stock: https://www.mouser.co.uk/ProductDetail/IQD/LFSPXO072801Reel?qs=HXFqYaX1Q2yCGu0eBJbHng%3D%3D; Arrow Part Number: LFSPXO072801REEL; Arrow Price/Stock: https://www.arrow.com/en/products/lfspxo072801reel/iqd-frequency-products?region=nac; Manufacturer Part Number: LFSPXO072801REEL

## Nets that join several sheets
3.3V: Power (9 pins), Sensors (34 pins)
3.3V GPS: Power (7 pins), Sensors (R18.2 R27.2)
5V CAN: Power (8 pins), Sensors (D14.1)
F9P_VCC_RF: Power (R1.2), Sensors (U2.7)
GND: Power (57 pins), Sensors (65 pins)
V_USB: Power (Q1.2 R6.1 R8.2 TP2.1), Sensors (C27.2 U2.38)
VBUS: Power (Q1.1 R6.2), Sensors (D14.2 D15.5 J6.2 J6.11)
BUZZER_TIM2_CH1: Power (Q4.1 R15.2), Sensors (U1.10)
CAN1_RX: Power (U7.4), Sensors (U1.32)
CAN1_TX: Power (U7.1), Sensors (U1.33)
F9P_ANT: Power (D2.2 J3.1 L1.1), Sensors (U2.2)
F9P_RXD2: Power (D6.1 J4.3), Sensors (U2.26)
F9P_TXD2: Power (D7.1 J4.2), Sensors (U2.27)
NetQ2_1: Power (Q2.1 R10.2), Sensors (U1.26)
NetR9_1: Power (R9.1 U7.8), Sensors (U1.25)
RTK_STAT: Power (Q3.1 R12.1), Sensors (U2.20)
SYS_SWCLK: Power (D9.1 J5.5), Sensors (U1.37)
SYS_SWDIO: Power (D10.1 J5.4), Sensors (U1.34)
TIMEPULSE: Power (Q5.1 R16.2), Sensors (U1.20 U2.53)
USART2_RX: Power (D11.1 J5.3), Sensors (U1.13)
USART2_TX: Power (D12.1 J5.2), Sensors (U1.12)